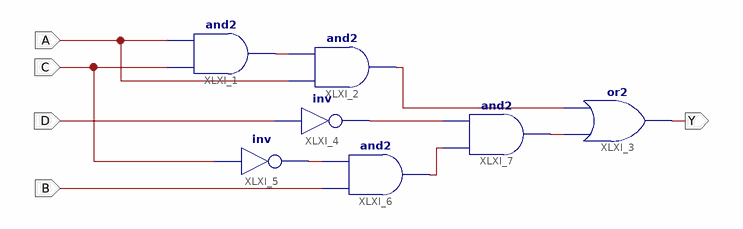
[diagram p0: schematic sheet 1]
// Xilinx ISE schematic MY_SCHEME.sch (virtex5) as structural Verilog: 7 symbols, 5 ports
module MY_SCHEME (
  input  D,
  input  A,
  input  C,
  input  B,
  output Y
);

  wire XLXN_8, XLXN_10, XLXN_13, XLXN_16, XLXN_24, XLXN_27;

  and XLXI_1 (XLXN_8, C, A);
  and XLXI_2 (XLXN_10, A, XLXN_8);
  or XLXI_3 (Y, XLXN_27, XLXN_10);
  not XLXI_4 (XLXN_24, D);
  not XLXI_5 (XLXN_13, C);
  and XLXI_6 (XLXN_16, B, XLXN_13);
  and XLXI_7 (XLXN_27, XLXN_16, XLXN_24);
endmodule
